# Altium schematic sheet Battery_Management.SchDoc
size A4; SheetNumber: 4; SheetTotal: 7
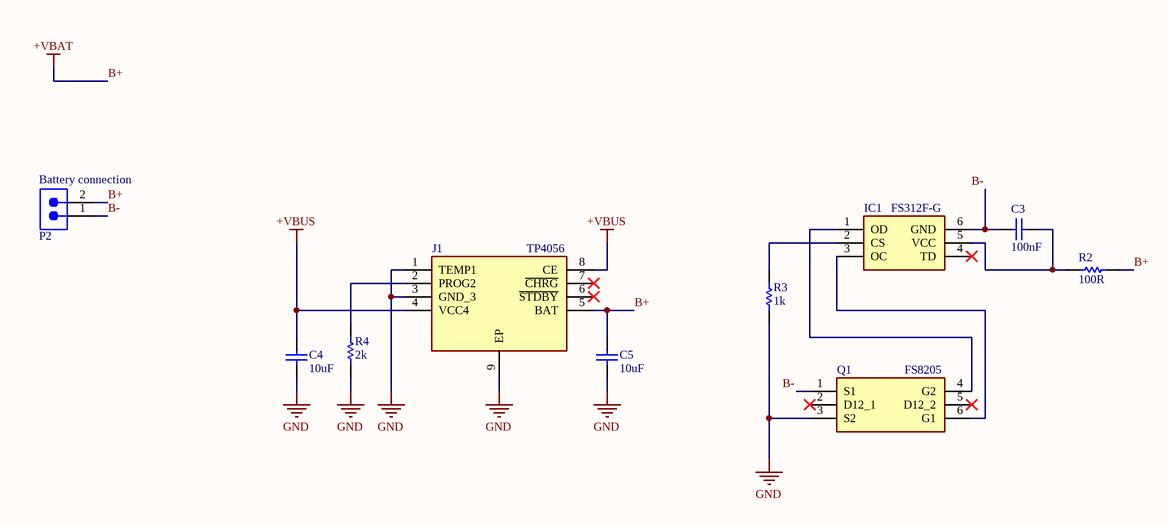
[diagram p0: Battery_Management.SchDoc]

## Parts
C3  value 100nF  [Wurth 0603 capacitor]  (hidden comment: Generic Capacitor 100nF 0603)
C4  value 10uF  [Wurth 0603 capacitor]  (hidden comment: Generic Capacitor 10uF 0603)
C5  value 10uF  [Wurth 0603 capacitor]  (hidden comment: Generic Capacitor 10uF 0603)
IC1  FS312F-G  [SOT95P280X145-6N]
J1  TP4056  [SOIC127P600X175-9N]
P2  Battery connection  [2x1 2.54mm]
Q1  FS8205  [FS8205]
R2  value 100R  [Wurth 0603 Resistor]  (hidden comment: Generic Resistor 100R 0603)
R3  value 1k  [Wurth 0603 Resistor]  (hidden comment: Generic Resistor 1k 0603)
R4  value 2k  [Wurth 0603 Resistor]  (hidden comment: Generic Resistor 2k 0603)

## Nets
+VBUS: C4.2 J1.4(VCC4) J1.8(CE)
B+: C5.2 J1.5(BAT) P2.2 R2.2  [also labelled +VBAT]
GND: C4.1 C5.1 J1.1(TEMP1) J1.3(GND_3) J1.9(EP) Q1.3(S2) R3.1 R4.1
B-: C3.1 IC1.6(GND) P2.1 Q1.1(S1)
NetC3_2: C3.2 IC1.5(VCC) R2.1
NetIC1_1: IC1.1(OD) Q1.4(G2)
NetIC1_2: IC1.2(CS) R3.2
NetIC1_3: IC1.3(OC) Q1.6(G1)
NetJ1_2: J1.2(PROG2) R4.2

Not connected (* = marked no-connect by the designer): IC1 4(TD)*; J1 6(~{STDBY})* 7(~{CHRG})*; Q1 2(D12_1)* 5(D12_2)*

## Library data of the parts
IC1 = FS312F-G: Integrated Circuit; Manufacturer_Name: Fortune Semiconductor Corporation; Datasheet Link: https://www.ic-fortune.com/upload/Download/FS312F-G-DS-12_EN.pdf; Height: 1.45mm; Manufacturer_Part_Number: FS312F-G
J1 = TP4056: Connector; Manufacturer_Name: NanJing Top Power; Datasheet Link: https://dlnmh9ip6v2uc.cloudfront.net/datasheets/Prototyping/TP4056.pdf; Height: 1.75mm; Manufacturer_Part_Number: TP4056
P2 = 61300211121: WR-PHD Pin Header, THT, Vertical, pitch 2.54mm, 1 Row, 2P; Manufacturer: Wurth Elektronik; Contact Resistance: 20mOhm; Rated Current: 3A; Working Voltage: 250V; Withstanding Voltage: 500V; Manufacturer Part Number: 61300211121; Category: Board-to-Board Connectors; Match Code: WR-PHD; ComponentLink1Description: Website Link; ComponentLink1URL: https://www.we-online.com/redexpert/article/61300211121?ad; ComponentLink2Description: Datasheet Link; ComponentLink2URL: https://www.we-online.com/redexpert/spec/61300211121?ad; Mount: Through Hole; Operating Temperature Max: 105°C; Operating Temperature Min: -40°C; Packaging: Bag; Gender: Pin Header; Number of Pins: 2; Number of Rows: 1; Orientation: Vertical; Pitch: 2.54mm
Q1 = FS8205: MOSFET (N-Channel); Manufacturer_Name: Fortune Semiconductor Corporation; Datasheet Link: https://www.ic-fortune.com/upload/Download/FS8205-DS-19_EN.pdf; Height: 1mm; Manufacturer_Part_Number: FS8205